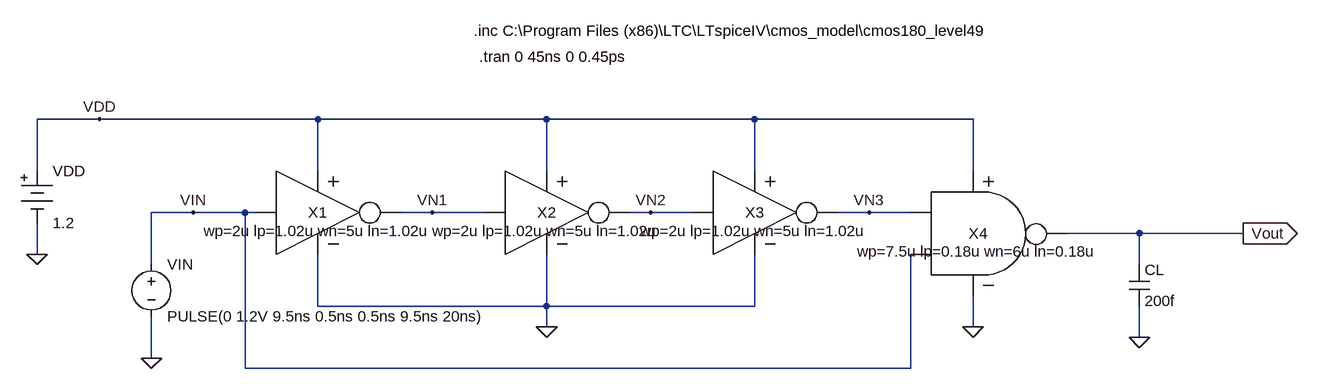
[diagram p0: schematic lab1-2.asc]
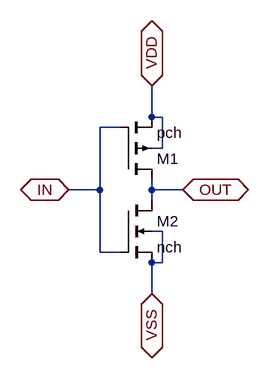
[diagram p1: sub-circuit inv.asc]
lab1-2.asc, the LTspice schematic file:
Version 4
SHEET 1 1752 772
WIRE -128 64 -224 64
WIRE 208 64 -128 64
WIRE 560 64 208 64
WIRE 880 64 560 64
WIRE 1216 64 880 64
WIRE -224 144 -224 64
WIRE 208 144 208 64
WIRE 560 144 560 64
WIRE 880 144 880 64
WIRE 1216 144 1216 64
WIRE 16 208 -48 208
WIRE 96 208 16 208
WIRE 112 208 96 208
WIRE 384 208 336 208
WIRE 464 208 384 208
WIRE 720 208 688 208
WIRE 784 208 720 208
WIRE 1056 208 1008 208
WIRE 1120 208 1056 208
WIRE 1472 240 1360 240
WIRE 1632 240 1472 240
WIRE -224 272 -224 224
WIRE -48 288 -48 208
WIRE 1472 288 1472 240
WIRE 208 352 208 272
WIRE 560 352 560 272
WIRE 560 352 208 352
WIRE 880 352 880 272
WIRE 880 352 560 352
WIRE 560 384 560 352
WIRE 1216 384 1216 336
WIRE 1472 400 1472 352
WIRE -48 432 -48 368
WIRE 96 448 96 208
WIRE 1120 448 1120 272
WIRE 1120 448 96 448
FLAG 1472 400 0
FLAG 1632 240 Vout
IOPIN 1632 240 Out
FLAG -48 432 0
FLAG -224 272 0
FLAG 1216 384 0
FLAG 560 384 0
FLAG 384 208 VN1
FLAG 720 208 VN2
FLAG 1056 208 VN3
FLAG -128 64 VDD
FLAG 16 208 VIN
SYMBOL Misc\\battery -224 128 R0
WINDOW 123 0 0 Left 2
WINDOW 39 0 0 Left 2
SYMATTR InstName VDD
SYMATTR Value 1.2
SYMBOL cap 1456 288 R0
SYMATTR InstName CL
SYMATTR Value 200f
SYMBOL voltage -48 272 R0
WINDOW 123 0 0 Left 2
WINDOW 39 0 0 Left 2
SYMATTR InstName VIN
SYMATTR Value PULSE(0 1.2V 9.5ns 0.5ns 0.5ns 9.5ns 20ns)
SYMBOL inv 208 208 R0
WINDOW 39 0 28 Center 2
SYMATTR SpiceLine wp=2u lp=1.02u wn=5u ln=1.02u
SYMATTR InstName X1
SYMBOL inv 560 208 R0
WINDOW 39 0 28 Center 2
SYMATTR SpiceLine wp=2u lp=1.02u wn=5u ln=1.02u
SYMATTR InstName X2
SYMBOL inv 880 208 R0
WINDOW 39 0 28 Center 2
SYMATTR SpiceLine wp=2u lp=1.02u wn=5u ln=1.02u
SYMATTR InstName X3
SYMBOL nand2 1232 240 R0
WINDOW 39 -8 28 Center 2
SYMATTR SpiceLine wp=7.5u lp=0.18u wn=6u ln=0.18u
SYMATTR InstName X4
TEXT 448 -72 Left 2 !.inc C:\\Program Files (x86)\\LTC\\LTspiceIV\\cmos_model\\cmos180_level49
TEXT 456 -32 Left 2 !.tran 0 45ns 0 0.45ps

inv.asc, the sub-circuit schematic file:
Version 4
SHEET 1 880 680
WIRE 240 32 240 -16
WIRE 256 32 240 32
WIRE 192 48 160 48
WIRE 256 80 256 32
WIRE 256 80 240 80
WIRE 160 144 160 48
WIRE 160 144 112 144
WIRE 240 144 240 128
WIRE 288 144 240 144
WIRE 240 160 240 144
WIRE 256 208 240 208
WIRE 160 240 160 144
WIRE 192 240 160 240
WIRE 256 256 256 208
WIRE 256 256 240 256
WIRE 240 304 240 256
FLAG 112 144 IN
IOPIN 112 144 BiDir
FLAG 288 144 OUT
IOPIN 288 144 BiDir
FLAG 240 -16 VDD
IOPIN 240 -16 BiDir
FLAG 240 304 VSS
IOPIN 240 304 BiDir
SYMBOL pmos4 192 128 M180
SYMATTR InstName M1
SYMATTR Value pch
SYMATTR Value2 l=lp w=wp
SYMBOL nmos4 192 160 R0
SYMATTR InstName M2
SYMATTR Value nch
SYMATTR Value2 l=ln w=wn

The netlist it stands for:
* lab1-2.asc
VDD VDD 0 1.2
CL Vout 0 200f
VIN VIN 0 PULSE(0 1.2V 9.5ns 0.5ns 0.5ns 9.5ns 20ns)
XX1 VIN VN1 VDD 0 inv params: wp=2u lp=1.02u wn=5u ln=1.02u
XX2 VN1 VN2 VDD 0 inv params: wp=2u lp=1.02u wn=5u ln=1.02u
XX3 VN2 VN3 VDD 0 inv params: wp=2u lp=1.02u wn=5u ln=1.02u
XX4 VN3 VIN Vout VDD 0 nand2 params: wp=7.5u lp=0.18u wn=6u ln=0.18u  ; pins A B Y VDD VSS

* block symbol definitions
.subckt inv IN OUT VDD VSS
M1 OUT IN VDD VDD pch l=lp w=wp
M2 OUT IN VSS VSS nch l=ln w=wn
.ends inv

.model NMOS NMOS
.model PMOS PMOS
.lib standard.mos
.inc C:\Program Files (x86)\LTC\LTspiceIV\cmos_model\cmos180_level49
.tran 0 45ns 0 0.45ps
.backanno
.end

* Results of the author's LTspice run, read from the files saved beside the schematic
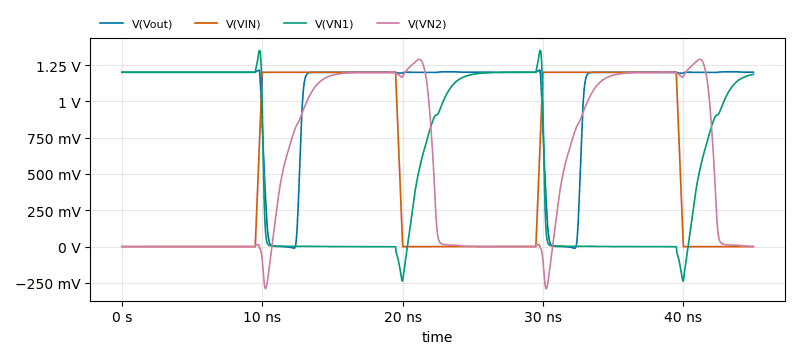
[diagram p2: Transient Analysis of lab1-2.asc, plotted from the saved traces]
* Transient Analysis, 1 run:
*   V(Vout): min -11.57 mV, max 1.215 V, average 1.062 V, rms 1.123 V, last 1.2 V
*   V(VIN): min 0 V, max 1.2 V, average 533.3 mV, rms 793.3 mV, last 0 V
*   V(VN1): min -237.2 mV, max 1.351 V, average 579.3 mV, rms 812.6 mV, last 1.186 V
*   V(VN2): min -290.3 mV, max 1.29 V, average 538.4 mV, rms 779.9 mV, last 946.6 µV